# EAGLE design Tiny 5 Stick SMD -v5 (EAGLE 6.4)
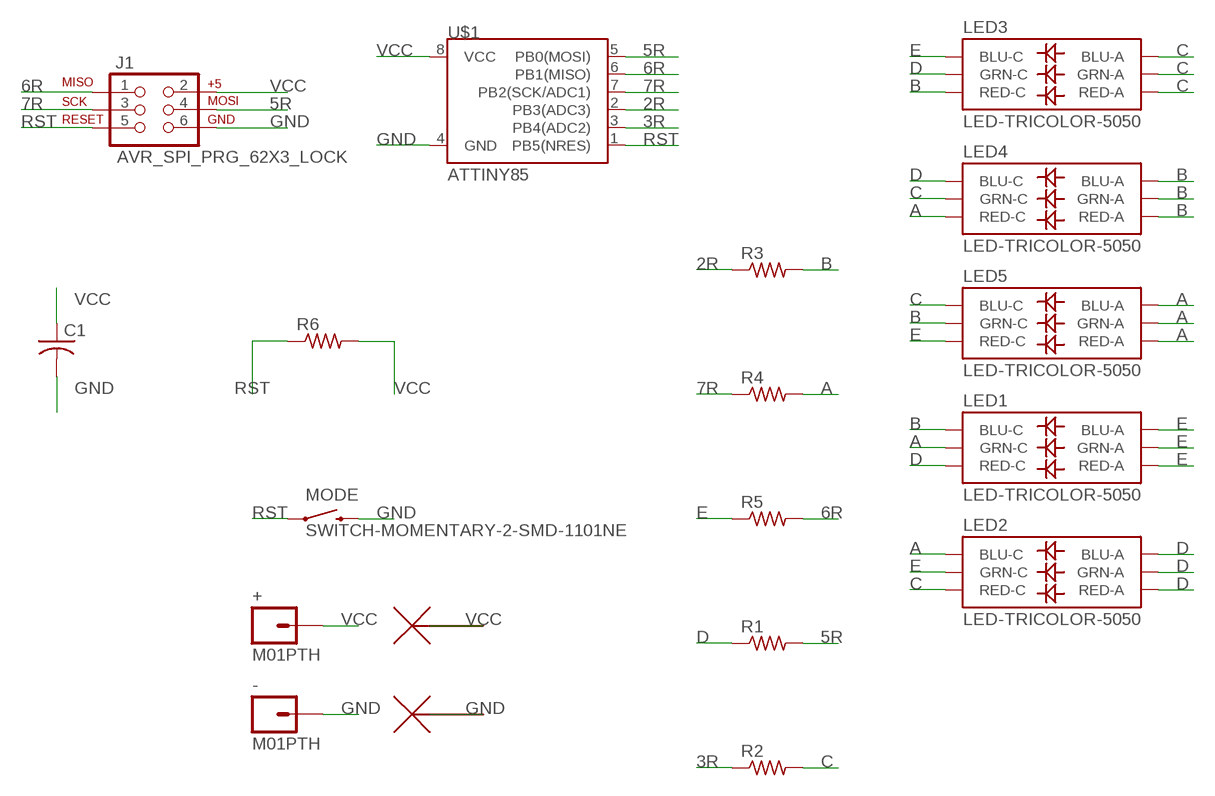
[diagram p0: schematic, sheet 1]

## Parts
+  M01PTH  [1X01]
-  M01PTH  [1X01]
C1  C-USC0805K  [C0805K]
GNDEXT  M01  [3X1.75]
J1  AVR_SPI_PRG_62X3_LOCK  [2X3_LOCK]
LED1  LED-TRICOLOR-5050  [LED-TRICOLOR-5050]
LED2  LED-TRICOLOR-5050  [LED-TRICOLOR-5050]
LED3  LED-TRICOLOR-5050  [LED-TRICOLOR-5050]
LED4  LED-TRICOLOR-5050  [LED-TRICOLOR-5050]
LED5  LED-TRICOLOR-5050  [LED-TRICOLOR-5050]
MODE  SWITCH-MOMENTARY-2-SMD-1101NE  [TACTILE-SWITCH-1101NE]
R1  R-US_M0805  [M0805]
R2  R-US_M0805  [M0805]
R3  R-US_M0805  [M0805]
R4  R-US_M0805  [M0805]
R5  R-US_M0805  [M0805]
R6  R-US_M0805  [M0805]
U$1  ATTINY85  ATTINY45  [SO08-EIAJ]
VCCEXT  M01  [3X1.75]

## Nets
2R: R3.1 U$1.2(PB3(ADC3))
3R: R2.1 U$1.3(PB4(ADC2))
5R: J1.4 R1.2 U$1.5(PB0(MOSI))
6R: J1.1 R5.2 U$1.6(PB1(MISO))
7R: J1.3 R4.1 U$1.7(PB2(SCK/ADC1))
A: LED1.4(GRN-C) LED2.6(BLU-C) LED4.5(RED-C) LED5.1(BLU-A) LED5.2(RED-A) LED5.3(GRN-A) R4.2
B: LED1.6(BLU-C) LED3.5(RED-C) LED4.1(BLU-A) LED4.2(RED-A) LED4.3(GRN-A) LED5.4(GRN-C) R3.2
C: LED2.5(RED-C) LED3.1(BLU-A) LED3.2(RED-A) LED3.3(GRN-A) LED4.4(GRN-C) LED5.6(BLU-C) R2.2
D: LED1.5(RED-C) LED2.1(BLU-A) LED2.2(RED-A) LED2.3(GRN-A) LED3.4(GRN-C) LED4.6(BLU-C) R1.1
E: LED1.1(BLU-A) LED1.2(RED-A) LED1.3(GRN-A) LED2.4(GRN-C) LED3.6(BLU-C) LED5.5(RED-C) R5.1
GND: -.1 C1.2 GNDEXT.P$1 J1.6 MODE.P$2 U$1.4(GND)
RST: J1.5 MODE.P$1 R6.1 U$1.1(PB5(NRES))
VCC: +.1 C1.1 J1.2 R6.2 U$1.8(VCC) VCCEXT.P$1

## Library data of the parts
+ - = SparkFun-Connectors:M01: Header 1 Standard 1-pin 0.1" header. Use with straight break away headers (SKU : PRT-00116), right angle break away headers (PRT-00553), swiss pins (PRT-00743), machine pins (PRT-00117), and female headers (PRT-00115).
C1 = adafruit:C-US: CAPACITOR, American symbol
GNDEXT VCCEXT = 00_PERSONAL:M01
J1 = SparkFun-Connectors:AVR_SPI_PRG_6: AVR ISP 6 Pin This is the reduced ISP connector for AVR programming. Common on Arduino. This footprint will take up less PCB space and can be used with a 10-pin to 6-pin adapter such as SKU: BOB-08508
LED1-LED5 = SparkFun:LED-TRICOLOR-5050
MODE = SparkFun-Electromechanical:SWITCH-MOMENTARY-2: Various NO switches- pushbuttons, reed, etc
R1-R6 = adafruit:R-US_: RESISTOR, American symbol
U$1 = SparkFun:ATTINY45: Atmel ATTiny45

## Board
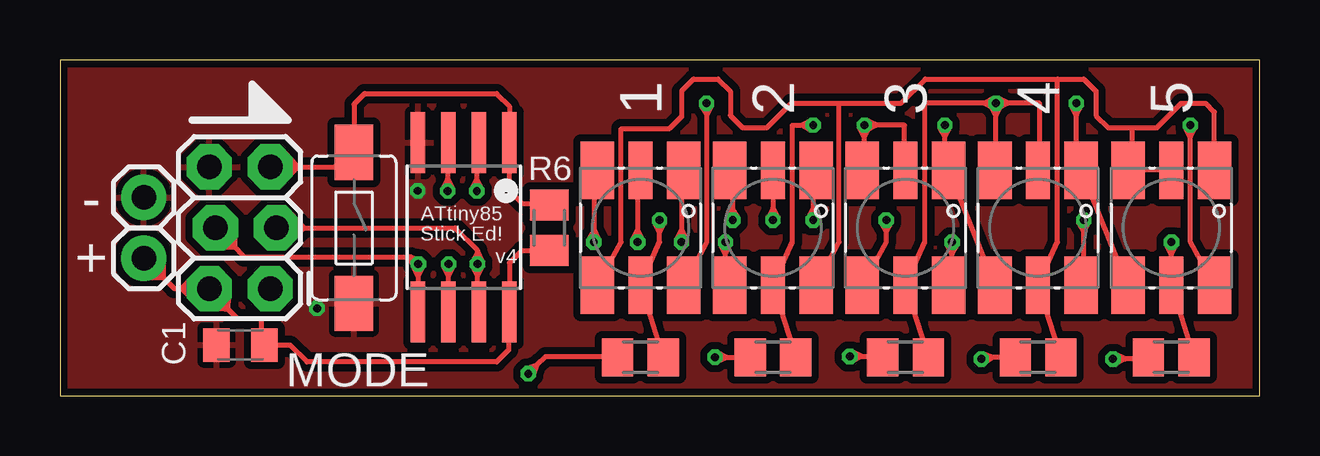
[diagram p1: board, top side]
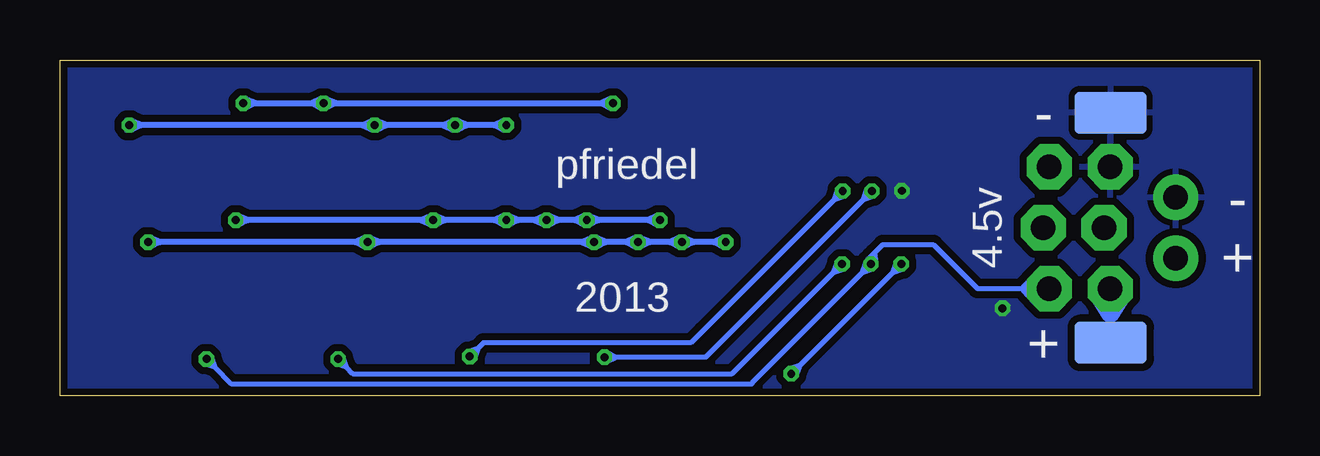
[diagram p2: board, bottom side, seen from below]

Size 50 x 14 mm. Coordinates in mm from the lower left corner, seen from the top.
Outline: 0,14 0,0 50,0 50,14 0,14
Copper layers (1*16): Top 0.035mm / dielectric 1.5mm / Bottom 0.035mm
Design rules "Fusion_eagle_rule_v1.1": minimum track width 6mil, minimum drill 12mil, track to track 6mil, track to pad 6mil, pad to pad 6mil, via to via 6mil, smd to smd 0mil, copper to edge 10mil, drill to drill 10mil, minimum pad ring 10mil, minimum via ring 6mil, stop-mask expansion 2mil, vias tented up to drill 100mil, thermal gap 10mil

### Footprints (pad centres in the part's own frame; a part is rotated, then mirrored left to right if it is on the bottom)
1X01 = drill 1.016 pad 1.88: 1 0,0
C0805K = smd 1.1 x 1.4: 1 -1,0; 2 1,0
3X1.75 = smd 3 x 1.75: P$1 0,0
2X3_LOCK = drill 1.016 pad 1.88 octagon: 1 0,0; 2 0,2.54; 3 2.54,-0.254; 4 2.54,2.286; 5 5.08,0; 6 5.08,2.54
LED-TRICOLOR-5050 = smd 2.4 x 1.4: 1 -2.4,1.8; 3 -2.4,-1.8; 4 2.4,-1.8; 6 2.4,1.8 | smd 2.4 x 1: 2 -2.4,0; 5 2.4,0
TACTILE-SWITCH-1101NE = smd 2.3 x 1.6: P$1 -3.15,0; P$2 3.15,0
M0805 = smd 1.3 x 1.6: 1 -0.95,0; 2 0.95,0
SO08-EIAJ = smd 0.61 x 2.54: 1 -1.905,-3.543; 2 -0.635,-3.543; 3 0.635,-3.543; 4 1.905,-3.543; 5 1.905,3.518; 6 0.635,3.518; 7 -0.635,3.518; 8 -1.905,3.518

### Placement (x,y rotation side)
+  3.49,5.73 180 top
-  3.49,8.27 0 top
C1  7.53,2.11 180 top
GNDEXT  6.2,11.8 0 bottom
J1  8.76,4.46 90 top
LED1  24.19,7 270 top
LED2  29.72,7 270 top
LED3  35.24,7 270 top
LED4  40.77,7 270 top
LED5  46.32,7 270 top
MODE  12.25,7 270 top
R1  24.19,1.59 180 top
R2  29.72,1.59 0 top
R3  35.24,1.59 0 top
R4  40.77,1.59 0 top
R5  46.32,1.59 180 top
R6  20.4,7 270 top
U$1  16.83,7 180 top
VCCEXT  6.2,2.2 0 bottom

### Tracks (layer width: path | path; a pad name or v marks a point on that pad's centre or on a via)
2R  (via drill 0.33)
  Top 0.203: U$1.2 arc90 17.37,10.45 17.37,9.03 | 17.37,9.03 v17.37,8.53 | v32.92,1.63 33.41,1.63 | 33.41,1.63 34.06,1.63 R3.1 | 17.37,9.03 17.18,8.63 v17.37,8.53 | 17.37,9.03 17.57,8.63 v17.37,8.53 | 33.41,1.63 33.01,1.82 v32.92,1.63 | 33.41,1.63 33.01,1.43 v32.92,1.63
  Bottom 0.203: v17.37,8.53 17.72,8.18 | 17.72,8.18 23.2,2.71 23.2,2.7 23.7,2.2 32.35,2.2 32.57,1.98 | 32.57,1.98 v32.92,1.63 | 17.72,8.18 17.58,8.61 v17.37,8.53 | 17.72,8.18 17.3,8.33 v17.37,8.53 | 32.57,1.98 32.71,1.56 v32.92,1.63 | 32.57,1.98 32.99,1.83 v32.92,1.63
3R  (via drill 0.33)
  Top 0.203: U$1.3 16.15,10.51 16.15,9.03 | 16.15,9.03 v16.15,8.53 | 28.7,1.52 R2.1 27.8,1.59 | v27.3,1.6 v27.3,1.59 27.8,1.59 | 16.15,9.03 15.96,8.63 v16.15,8.53 | 16.15,9.03 16.35,8.63 v16.15,8.53 | 27.8,1.59 27.4,1.79 v27.3,1.6 | 27.8,1.59 27.39,1.41 v27.3,1.6
  Bottom 0.203: v16.15,8.53 16.5,8.18 | 16.5,8.18 23.09,1.6 26.8,1.6 | 26.8,1.6 v27.3,1.6 | 16.5,8.18 16.36,8.61 v16.15,8.53 | 16.5,8.18 16.08,8.33 v16.15,8.53 | 26.8,1.6 27.21,1.41 v27.3,1.6 | 26.8,1.6 27.21,1.79 v27.3,1.6
5R  (via drill 0.33)
  Top 0.203: R1.2 23.27,1.62 20.23,1.62 19.87,1.26 | v14.94,5.49 14.92,5.47 14.92,4.99 | 14.92,4.99 U$1.5 | J1.4 7.2,6.28 7.69,5.79 14.54,5.79 | 14.54,5.79 14.63,5.79 v14.94,5.49 | 19.87,1.26 v19.52,0.91 | 19.87,1.26 19.45,1.12 v19.52,0.91 | 19.87,1.26 19.73,0.84 v19.52,0.91 | 14.92,4.99 15.13,5.39 v14.94,5.49 | 14.92,4.99 14.74,5.4 v14.94,5.49 | 14.54,5.79 14.74,5.39 v14.94,5.49 | 14.54,5.79 14.98,5.7 v14.94,5.49
  Top 0.406: 7.2,6.28 7.21,6.98 J1.4 6.5,6.26 7.2,6.28
  Bottom 0.203: v14.94,5.49 15.29,5.14 | 15.29,5.14 19.16,1.26 | 19.16,1.26 19.51,0.91 v19.52,0.91 | 19.16,1.26 19.32,0.84 v19.52,0.91 | 19.16,1.26 19.59,1.12 v19.52,0.91 | 15.29,5.14 15.14,5.56 v14.94,5.49 | 15.29,5.14 14.86,5.28 v14.94,5.49
6R  (via drill 0.33)
  Top 0.203: R5.2 45.3,1.52 44.39,1.52 | 44.39,1.52 v43.89,1.52 | U$1.6 16.19,4.99 | 16.19,4.99 16.19,5.39 v16.2,5.49 | 44.39,1.52 43.98,1.72 v43.89,1.52 | 44.39,1.52 43.98,1.33 v43.89,1.52 | 16.19,4.99 16.39,5.39 v16.2,5.49 | 16.19,4.99 16,5.39 v16.2,5.49
  Bottom 0.203: J1.1 9.78,4.46 11.76,4.46 13.6,6.3 15.7,6.3 16.04,5.96 | 43.54,1.17 42.87,0.5 21.14,0.5 21.14,0.55 16.55,5.14 | 43.54,1.17 v43.89,1.52 | 16.55,5.14 v16.2,5.49 | v16.2,5.49 16.2,5.8 16.04,5.96 | 43.54,1.17 43.96,1.32 v43.89,1.52 | 43.54,1.17 43.69,1.59 v43.89,1.52 | 16.55,5.14 16.4,5.56 v16.2,5.49 | 16.55,5.14 16.13,5.28 v16.2,5.49 | 16.04,5.96 15.99,5.51 v16.2,5.49 | 16.04,5.96 16.36,5.64 v16.2,5.49
  Bottom 0.406: 9.78,4.46 9.3,4.97 J1.1 9.3,3.95 9.78,4.46
7R  (via drill 0.33)
  Top 0.203: R4.1 38.9,1.59 | 38.9,1.59 38.48,1.59 v38.41,1.52 | J1.3 10.03,7 16.47,7 17.4,6.07 17.4,5.98 | U$1.7 17.4,3.54 17.4,4.99 | 17.4,4.99 v17.4,5.49 | 17.4,5.98 v17.4,5.49 | 38.9,1.59 38.47,1.73 v38.41,1.52 | 38.9,1.59 38.53,1.34 v38.41,1.52 | 17.4,4.99 17.59,5.39 v17.4,5.49 | 17.4,4.99 17.21,5.39 v17.4,5.49 | 17.4,5.98 17.21,5.58 v17.4,5.49 | 17.4,5.98 17.59,5.58 v17.4,5.49
  Top 0.406: 10.03,7 9.55,7.51 J1.3 9.55,6.49 10.03,7
  Bottom 0.203: 38.05,1.17 37.8,0.91 21.99,0.91 v17.4,5.49 | 38.05,1.17 v38.41,1.52 | 38.05,1.17 38.48,1.32 v38.41,1.52 | 38.05,1.17 38.2,1.59 v38.41,1.52 | v17.4,5.49 17.6,5.56 17.75,5.14 17.33,5.28 v17.4,5.49
A
  Top 0.203: LED1.4 23.39,6.4 23.39,11.12 25.4,11.12 25.91,11.63 25.91,12.7 26.42,13.21 27.43,13.21 27.94,12.7 27.94,11.68 28.45,11.18 29.46,11.18 30.48,12.19 32.47,12.19 | R4.2 LED4.5 41.58,6.4 41.58,13.21 | LED2.6 32.47,6.4 32.47,12.19 | LED5.3 44.5,9.42 | 46.33,9.41 LED5.2 LED5.3 | 32.47,12.19 35.05,12.19 36.07,13.21 41.58,13.21 | 41.58,13.21 42.67,13.21 43.18,12.7 43.18,11.68 43.69,11.18 44.7,11.18 | LED5.3 44.2,9.4 | LED5.1 48.12,11.83 47.75,12.19 46.74,12.19 45.72,11.18 44.7,11.18 | LED5.3 44.7,9.59 44.7,11.18
B  (via drill 0.33)
  Top 0.203: LED1.6 26.96,6.4 26.96,11.7 | 26.96,11.7 v26.95,12.19 | R3.2 LED3.5 36.04,6.4 36.04,12.19 38.52,12.19 | LED4.3 39.01,9.4 39.01,11.7 | 39.01,11.7 v39.01,12.19 | v39.01,12.19 38.52,12.19 | LED4.2 40.84,9.4 40.84,12.19 39.51,12.19 | 39.51,12.19 v39.01,12.19 | 42.37,11.7 42.37,9.4 LED4.1 LED5.4 | 42.37,11.7 v42.37,12.19 | 26.96,11.7 27.16,12.07 v26.95,12.19 | 26.96,11.7 | 26.96,11.7 26.74,12.07 v26.95,12.19 | 39.01,11.7 39.23,12.07 v39.01,12.19 | 39.01,11.7 38.8,12.07 v39.01,12.19 | 38.52,12.19 38.9,11.98 v39.01,12.19 | 38.52,12.19 38.9,12.4 v39.01,12.19 | 39.51,12.19 39.13,12.4 v39.01,12.19 | 39.51,12.19 39.13,11.98 v39.01,12.19 | 42.37,11.7 42.58,12.07 v42.37,12.19 | 42.37,11.7 42.16,12.07 v42.37,12.19 | 26.96,11.7 27.15,12.1 | 27.15,12.1 | v26.95,12.19 27.15,12.1 | 26.96,11.7 26.76,12.09 | 26.76,12.09 | v26.95,12.19 26.76,12.09 | 26.96,11.7 27.15,12.1 | 27.15,12.1 | v26.95,12.19 27.15,12.1 | 26.96,11.7 26.76,12.09 | v26.95,12.19 26.76,12.09 | 26.96,11.7 27.15,12.1 | v26.95,12.19 27.15,12.1 | 26.96,11.7 26.76,12.09 | v26.95,12.19 26.76,12.09 | 39.01,11.7 39.21,12.1 | v39.01,12.19 39.21,12.1 | 39.01,11.7 38.82,12.1 | v39.01,12.19 38.82,12.1 | 38.52,12.19 | 38.52,12.19 38.92,12 | v39.01,12.19 38.92,12 | 38.52,12.19 | 38.52,12.19 38.92,12.39 | v39.01,12.19 38.92,12.39 | 39.51,12.19 39.11,12.39 | v39.01,12.19 39.11,12.39 | 39.51,12.19 39.11,12 | v39.01,12.19 39.11,12 | 39.01,11.7 39.21,12.1 | 39.21,12.1 | 39.01,11.7 38.82,12.1 | v39.01,12.19 38.82,12.1 | 39.01,11.7 39.21,12.1 | v39.01,12.19 39.21,12.1 | 39.01,11.7 38.82,12.1 | v39.01,12.19 38.82,12.1 | 38.52,12.19 38.92,12 | 38.92,12 | 38.52,12.19 38.92,12.39 | v39.01,12.19 38.92,12.39 | 38.52,12.19 38.92,12 | v39.01,12.19 38.92,12
  Top 0.203: 38.52,12.19 38.92,12.39 | v39.01,12.19 38.92,12.39 | 39.51,12.19 39.11,12.39 | 39.11,12.39 | 39.51,12.19 39.11,12 | v39.01,12.19 39.11,12 | 39.51,12.19 39.11,12.39 | v39.01,12.19 39.11,12.39 | 39.51,12.19 39.11,12 | v39.01,12.19 39.11,12 | 42.37,11.7 42.56,12.1 | v42.37,12.19 42.56,12.1 | 42.37,11.7 42.17,12.1 | v42.37,12.19 42.17,12.1 | 42.37,11.7 42.56,12.1 | 42.56,12.1 | 42.37,11.7 42.17,12.1 | v42.37,12.19 42.17,12.1 | 42.37,11.7 42.56,12.1 | v42.37,12.19 42.56,12.1 | 42.37,11.7 42.17,12.1 | v42.37,12.19 42.17,12.1
  Bottom 0.254: v42.37,12.19 41.87,12.19 | 41.87,12.19 39.51,12.19 | 39.51,12.19 v39.01,12.19 | v39.01,12.19 38.52,12.19 | 38.52,12.19 27.45,12.19 | 27.45,12.19 v26.95,12.19 | 27.45,12.19 27.04,12.39 v26.95,12.19 | 27.45,12.19 27.04,12 v26.95,12.19 | 39.51,12.19 39.11,12.39 v39.01,12.19 | 39.51,12.19 39.11,12 v39.01,12.19 | 38.52,12.19 | 38.52,12.19 38.92,12 v39.01,12.19 | 38.52,12.19 38.92,12.39 v39.01,12.19 | 41.87,12.19 | 41.87,12.19 42.27,12 v42.37,12.19 | 41.87,12.19 42.27,12.39 v42.37,12.19 | 27.45,12.19 27.02,12.37 | v26.95,12.19 27.02,12.37 | 27.45,12.19 27.02,12.02 | v26.95,12.19 27.02,12.02 | 27.45,12.19 27.02,12.37 | 27.02,12.37 | v26.95,12.19 27.02,12.37 | 27.45,12.19 27.02,12.02 | v26.95,12.19 27.02,12.02 | 27.45,12.19 27.02,12.37 | v26.95,12.19 27.02,12.37 | 27.45,12.19 27.02,12.02 | v26.95,12.19 27.02,12.02 | 39.51,12.19 39.09,12.37 | v39.01,12.19 39.09,12.37 | 39.51,12.19 39.09,12.02 | v39.01,12.19 39.09,12.02 | 38.52,12.19 38.94,12.02 | v39.01,12.19 38.94,12.02 | 38.52,12.19 | 38.52,12.19 38.94,12.37 | v39.01,12.19 38.94,12.37 | 39.51,12.19 39.09,12.37 | 39.09,12.37 | v39.01,12.19 39.09,12.37 | 39.51,12.19 39.09,12.02 | v39.01,12.19 39.09,12.02 | 39.51,12.19 39.09,12.37 | v39.01,12.19 39.09,12.37 | 39.51,12.19 39.09,12.02 | v39.01,12.19 39.09,12.02 | 38.52,12.19 38.94,12.02 | 38.94,12.02 | v39.01,12.19 38.94,12.02 | 38.52,12.19 38.94,12.37 | v39.01,12.19 38.94,12.37 | 38.52,12.19 38.94,12.02 | v39.01,12.19 38.94,12.02 | 38.52,12.19 38.94,12.37 | v39.01,12.19 38.94,12.37 | 41.87,12.19 42.29,12.02 | v42.37,12.19 42.29,12.02 | 41.87,12.19 | 41.87,12.19 42.29,12.37 | v42.37,12.19 42.29,12.37 | 41.87,12.19 42.29,12.02 | 42.29,12.02 | v42.37,12.19 42.29,12.02 | 41.87,12.19 42.29,12.37
  Bottom 0.254: v42.37,12.19 42.29,12.37 | 41.87,12.19 42.29,12.02 | v42.37,12.19 42.29,12.02 | 41.87,12.19 42.29,12.37 | v42.37,12.19 42.29,12.37
C  (via drill 0.33)
  Top 0.203: R2.2 LED2.5 30.53,6.4 30.53,11.28 30.9,11.28 | LED3.3 33.53,9.49 33.53,10.78 | 33.53,10.78 v33.53,11.28 | LED3.2 35.2,9.44 35.2,11.28 34.02,11.28 | 34.02,11.28 v33.53,11.28 | 30.9,11.28 v31.39,11.28 | LED4.4 LED3.1 36.88,9.41 36.88,10.78 | 36.88,10.78 v36.88,11.28 | LED5.6 47.12,6.4 47.12,10.78 | 47.12,10.78 v47.12,11.28 | 33.53,10.78 33.74,11.16 v33.53,11.28 | 33.53,10.78 33.32,11.16 v33.53,11.28 | 34.02,11.28 33.65,11.49 v33.53,11.28 | 34.02,11.28 33.65,11.07 v33.53,11.28 | 30.9,11.28 31.28,11.07 v31.39,11.28 | 30.9,11.28 31.28,11.49 v31.39,11.28 | 36.88,10.78 37.09,11.16 v36.88,11.28 | 36.88,10.78 36.67,11.16 v36.88,11.28 | 47.12,10.78 47.33,11.16 v47.12,11.28 | 47.12,10.78 46.91,11.16 v47.12,11.28 | 33.53,10.78 33.72,11.18 | v33.53,11.28 33.72,11.18 | 33.53,10.78 33.33,11.18 | v33.53,11.28 33.33,11.18 | 34.02,11.28 33.62,11.47 | v33.53,11.28 33.62,11.47 | 34.02,11.28 33.62,11.08 | v33.53,11.28 33.62,11.08 | 33.53,10.78 33.72,11.18 | 33.72,11.18 | 33.53,10.78 33.33,11.18 | v33.53,11.28 33.33,11.18 | 33.53,10.78 33.72,11.18 | v33.53,11.28 33.72,11.18 | 33.53,10.78 33.33,11.18 | v33.53,11.28 33.33,11.18 | 34.02,11.28 33.62,11.47 | 33.62,11.47 | 34.02,11.28 33.62,11.08 | v33.53,11.28 33.62,11.08 | 34.02,11.28 33.62,11.47 | v33.53,11.28 33.62,11.47 | 34.02,11.28 33.62,11.08 | v33.53,11.28 33.62,11.08 | 30.9,11.28 | 30.9,11.28 31.3,11.08 | v31.39,11.28 31.3,11.08 | 30.9,11.28 | 30.9,11.28 31.3,11.47 | v31.39,11.28 31.3,11.47 | 30.9,11.28 31.3,11.08 | 31.3,11.08 | 30.9,11.28 31.3,11.47 | v31.39,11.28 31.3,11.47 | 30.9,11.28 31.3,11.08 | v31.39,11.28 31.3,11.08 | 30.9,11.28 31.3,11.47 | v31.39,11.28 31.3,11.47 | 36.88,10.78 37.08,11.18 | v36.88,11.28 37.08,11.18
  Top 0.203: 36.88,10.78 36.69,11.18 | v36.88,11.28 36.69,11.18 | 36.88,10.78 37.08,11.18 | 37.08,11.18 | 36.88,10.78 36.69,11.18 | v36.88,11.28 36.69,11.18 | 36.88,10.78 37.08,11.18 | v36.88,11.28 37.08,11.18 | 36.88,10.78 36.69,11.18 | v36.88,11.28 36.69,11.18 | 47.12,10.78 47.31,11.18 | v47.12,11.28 47.31,11.18 | 47.12,10.78 46.92,11.18 | v47.12,11.28 46.92,11.18 | 47.12,10.78 47.31,11.18 | 47.31,11.18 | 47.12,10.78 46.92,11.18 | v47.12,11.28 46.92,11.18 | 47.12,10.78 47.31,11.18 | v47.12,11.28 47.31,11.18 | 47.12,10.78 46.92,11.18 | v47.12,11.28 46.92,11.18
  Bottom 0.254: v31.39,11.28 31.89,11.28 | 31.89,11.28 33.03,11.28 | 33.03,11.28 v33.53,11.28 | v33.53,11.28 34.02,11.28 | 34.02,11.28 36.38,11.28 | 36.39,11.28 v36.88,11.28 | v36.88,11.28 37.38,11.28 | 37.38,11.28 46.62,11.28 | 46.62,11.28 v47.12,11.28 | 33.03,11.28 | 33.03,11.28 33.43,11.08 v33.53,11.28 | 33.03,11.28 33.43,11.47 v33.53,11.28 | 34.02,11.28 33.62,11.47 v33.53,11.28 | 34.02,11.28 33.62,11.08 v33.53,11.28 | 31.89,11.28 31.49,11.47 v31.39,11.28 | 31.89,11.28 31.49,11.08 v31.39,11.28 | 36.38,11.28 36.39,11.28 | 36.39,11.28 36.79,11.08 v36.88,11.28 | 36.39,11.28 36.79,11.47 v36.88,11.28 | 37.38,11.28 36.98,11.47 v36.88,11.28 | 37.38,11.28 36.98,11.08 v36.88,11.28 | 46.62,11.28 | 46.62,11.28 47.02,11.08 v47.12,11.28 | 46.62,11.28 47.02,11.47 v47.12,11.28 | v47.12,11.28 47.21,11.47 | v47.12,11.28 47.21,11.08 | 33.03,11.28 33.45,11.1 | v33.53,11.28 33.45,11.1 | 33.03,11.28 | 33.03,11.28 33.45,11.45 | v33.53,11.28 33.45,11.45 | 34.02,11.28 33.6,11.45 | v33.53,11.28 33.6,11.45 | 34.02,11.28 33.6,11.1 | v33.53,11.28 33.6,11.1 | 33.03,11.28 33.45,11.1 | 33.45,11.1 | v33.53,11.28 33.45,11.1 | 33.03,11.28 33.45,11.45 | v33.53,11.28 33.45,11.45 | 33.03,11.28 33.45,11.1 | v33.53,11.28 33.45,11.1 | 33.03,11.28 33.45,11.45 | v33.53,11.28 33.45,11.45 | 34.02,11.28 33.6,11.45 | 33.6,11.45 | v33.53,11.28 33.6,11.45 | 34.02,11.28 33.6,11.1 | v33.53,11.28 33.6,11.1 | 34.02,11.28 33.6,11.45 | v33.53,11.28 33.6,11.45 | 34.02,11.28 33.6,11.1 | v33.53,11.28 33.6,11.1 | 31.89,11.28 31.47,11.45 | v31.39,11.28 31.47,11.45 | 31.89,11.28 31.47,11.1 | v31.39,11.28 31.47,11.1 | 31.89,11.28 31.47,11.45 | 31.47,11.45 | v31.39,11.28 31.47,11.45 | 31.89,11.28 31.47,11.1 | v31.39,11.28 31.47,11.1
  Bottom 0.254: 31.89,11.28 31.47,11.45 | v31.39,11.28 31.47,11.45 | 31.89,11.28 31.47,11.1 | v31.39,11.28 31.47,11.1 | 36.39,11.28 36.81,11.1 | v36.88,11.28 36.81,11.1 | 36.38,11.28 36.39,11.28 | 36.39,11.28 36.81,11.45 | v36.88,11.28 36.81,11.45 | 37.38,11.28 36.95,11.45 | v36.88,11.28 36.95,11.45 | 37.38,11.28 36.95,11.1 | v36.88,11.28 36.95,11.1 | 36.39,11.28 36.81,11.1 | 36.81,11.1 | v36.88,11.28 36.81,11.1 | 36.39,11.28 36.81,11.45 | v36.88,11.28 36.81,11.45 | 36.39,11.28 36.81,11.1 | v36.88,11.28 36.81,11.1 | 36.39,11.28 36.81,11.45 | v36.88,11.28 36.81,11.45 | 37.38,11.28 36.95,11.45 | 36.95,11.45 | v36.88,11.28 36.95,11.45 | 37.38,11.28 36.95,11.1 | v36.88,11.28 36.95,11.1 | 37.38,11.28 36.95,11.45 | v36.88,11.28 36.95,11.45 | 37.38,11.28 36.95,11.1 | v36.88,11.28 36.95,11.1 | 46.62,11.28 47.04,11.1 | v47.12,11.28 47.04,11.1 | 46.62,11.28 | 46.62,11.28 47.04,11.45 | v47.12,11.28 47.04,11.45 | 46.62,11.28 47.04,11.1 | 47.04,11.1 | v47.12,11.28 47.04,11.1 | 46.62,11.28 47.04,11.45 | v47.12,11.28 47.04,11.45 | 46.62,11.28 47.04,11.1 | v47.12,11.28 47.04,11.1 | 46.62,11.28 47.04,11.45 | v47.12,11.28 47.04,11.45
D  (via drill 0.33)
  Top 0.203: 24.99,6.82 24.99,6.4 LED1.5 R1.1 | 24.99,6.82 v24.99,7.32 | LED2.3 28.04,9.4 28.04,7.81 | 28.04,7.81 v28.04,7.32 | LED2.2 29.72,7.81 | 29.72,7.81 v29.72,7.32 | LED2.1 31.39,9.4 31.39,7.81 | 31.39,7.81 v31.39,7.32 | LED3.4 34.44,6.4 34.44,6.82 | 34.44,6.82 v34.44,7.32 | LED4.6 42.67,4.71 42.67,6.82 | 42.67,6.82 v42.67,7.32 | 24.99,6.82 25.2,7.2 v24.99,7.32 | 24.99,6.82 24.78,7.2 v24.99,7.32 | 28.04,7.81 27.83,7.43 v28.04,7.32 | 28.04,7.81 28.25,7.43 v28.04,7.32 | 29.72,7.81 29.51,7.43 v29.72,7.32 | 29.72,7.81 29.93,7.43 v29.72,7.32 | 31.39,7.81 31.18,7.43 v31.39,7.32 | 31.39,7.81 31.61,7.43 v31.39,7.32 | 34.44,6.82 34.65,7.2 v34.44,7.32 | 34.44,6.82 34.23,7.2 v34.44,7.32 | 42.67,6.82 42.88,7.2 v42.67,7.32 | 42.67,6.82 42.46,7.2 v42.67,7.32 | 24.99,6.82 25.19,7.22 | v24.99,7.32 25.19,7.22 | 24.99,6.82 24.8,7.22 | v24.99,7.32 24.8,7.22 | 24.99,6.82 25.19,7.22 | 25.19,7.22 | 24.99,6.82 24.8,7.22 | v24.99,7.32 24.8,7.22 | 24.99,6.82 25.19,7.22 | v24.99,7.32 25.19,7.22 | 24.99,6.82 24.8,7.22 | v24.99,7.32 24.8,7.22 | 28.04,7.81 | 28.04,7.81 27.85,7.41 | v28.04,7.32 27.85,7.41 | 28.04,7.81 | 28.04,7.81 28.24,7.41 | v28.04,7.32 28.24,7.41 | 28.04,7.81 27.85,7.41 | 27.85,7.41 | 28.04,7.81 28.24,7.41 | v28.04,7.32 28.24,7.41 | 28.04,7.81 27.85,7.41 | v28.04,7.32 27.85,7.41 | 28.04,7.81 28.24,7.41 | v28.04,7.32 28.24,7.41 | 29.72,7.81 | 29.72,7.81 29.52,7.41 | v29.72,7.32 29.52,7.41 | 29.72,7.81 | 29.72,7.81 29.91,7.41 | v29.72,7.32 29.91,7.41 | 29.72,7.81 29.52,7.41 | 29.52,7.41 | 29.72,7.81 29.91,7.41 | v29.72,7.32 29.91,7.41 | 29.72,7.81 29.52,7.41 | v29.72,7.32 29.52,7.41 | 29.72,7.81 29.91,7.41 | v29.72,7.32 29.91,7.41 | 31.39,7.81 | 31.39,7.81 31.2,7.41 | v31.39,7.32 31.2,7.41
  Top 0.203: 31.39,7.81 | 31.39,7.81 31.59,7.41 | v31.39,7.32 31.59,7.41 | 31.39,7.81 31.2,7.41 | 31.2,7.41 | 31.39,7.81 31.59,7.41 | v31.39,7.32 31.59,7.41 | 31.39,7.81 31.2,7.41 | v31.39,7.32 31.2,7.41 | 31.39,7.81 31.59,7.41 | v31.39,7.32 31.59,7.41 | 34.44,6.82 34.64,7.22 | v34.44,7.32 34.64,7.22 | 34.44,6.82 34.25,7.22 | v34.44,7.32 34.25,7.22 | 34.44,6.82 34.64,7.22 | 34.64,7.22 | 34.44,6.82 34.25,7.22 | v34.44,7.32 34.25,7.22 | 34.44,6.82 34.64,7.22 | v34.44,7.32 34.64,7.22 | 34.44,6.82 34.25,7.22 | v34.44,7.32 34.25,7.22 | 42.67,6.82 42.87,7.22 | v42.67,7.32 42.87,7.22 | 42.67,6.82 42.48,7.22 | v42.67,7.32 42.48,7.22 | 42.67,6.82 42.87,7.22 | 42.87,7.22 | 42.67,6.82 42.48,7.22 | v42.67,7.32 42.48,7.22 | 42.67,6.82 42.87,7.22 | v42.67,7.32 42.87,7.22 | 42.67,6.82 42.48,7.22 | v42.67,7.32 42.48,7.22
  Bottom 0.254: v24.99,7.32 25.49,7.32 | 25.49,7.32 27.55,7.32 | 27.55,7.32 v28.04,7.32 | v28.04,7.32 28.54,7.32 | 28.54,7.32 29.22,7.32 | 29.22,7.32 v29.72,7.32 | v29.72,7.32 30.21,7.32 | 30.21,7.32 30.9,7.32 | 30.9,7.32 v31.39,7.32 | v31.39,7.32 31.89,7.32 | 31.89,7.32 33.95,7.32 | 33.95,7.32 v34.44,7.32 | v34.44,7.32 34.94,7.32 | 34.94,7.32 42.18,7.32 | 42.18,7.32 v42.67,7.32 | 25.49,7.32 25.09,7.51 v24.99,7.32 | 25.49,7.32 25.09,7.12 v24.99,7.32 | 27.55,7.32 | 27.55,7.32 27.95,7.12 v28.04,7.32 | 27.55,7.32 27.95,7.51 v28.04,7.32 | 28.54,7.32 28.14,7.51 v28.04,7.32 | 28.54,7.32 28.14,7.12 v28.04,7.32 | 29.22,7.32 | 29.22,7.32 29.62,7.12 v29.72,7.32 | 29.22,7.32 29.62,7.51 v29.72,7.32 | 30.21,7.32 29.81,7.51 v29.72,7.32 | 30.21,7.32 29.81,7.12 v29.72,7.32 | 30.9,7.32 | 30.9,7.32 31.3,7.12 v31.39,7.32 | 30.9,7.32 31.3,7.51 v31.39,7.32 | 31.89,7.32 31.49,7.51 v31.39,7.32 | 31.89,7.32 31.49,7.12 v31.39,7.32 | 33.95,7.32 | 33.95,7.32 34.35,7.12 v34.44,7.32 | 33.95,7.32 34.35,7.51 v34.44,7.32 | 34.94,7.32 34.54,7.51 v34.44,7.32 | 34.94,7.32 34.54,7.12 v34.44,7.32 | 42.18,7.32 | 42.18,7.32 42.58,7.12 v42.67,7.32 | 42.18,7.32 42.58,7.51 v42.67,7.32 | 25.49,7.32 25.07,7.49 | v24.99,7.32 25.07,7.49 | 25.49,7.32 25.07,7.14 | v24.99,7.32 25.07,7.14 | 25.49,7.32 25.07,7.49 | 25.07,7.49 | v24.99,7.32 25.07,7.49 | 25.49,7.32 25.07,7.14 | v24.99,7.32 25.07,7.14 | 25.49,7.32 25.07,7.49 | v24.99,7.32 25.07,7.49 | 25.49,7.32 25.07,7.14 | v24.99,7.32 25.07,7.14 | 27.55,7.32 27.97,7.14 | v28.04,7.32 27.97,7.14 | 27.55,7.32 | 27.55,7.32 27.97,7.49 | v28.04,7.32 27.97,7.49 | 28.54,7.32 28.11,7.49 | v28.04,7.32 28.11,7.49 | 28.54,7.32 28.11,7.14 | v28.04,7.32 28.11,7.14 | 27.55,7.32 27.97,7.14 | 27.97,7.14
  Bottom 0.254: v28.04,7.32 27.97,7.14 | 27.55,7.32 27.97,7.49 | v28.04,7.32 27.97,7.49 | 27.55,7.32 27.97,7.14 | v28.04,7.32 27.97,7.14 | 27.55,7.32 27.97,7.49 | v28.04,7.32 27.97,7.49 | 28.54,7.32 28.11,7.49 | 28.11,7.49 | v28.04,7.32 28.11,7.49 | 28.54,7.32 28.11,7.14 | v28.04,7.32 28.11,7.14 | 28.54,7.32 28.11,7.49 | v28.04,7.32 28.11,7.49 | 28.54,7.32 28.11,7.14 | v28.04,7.32 28.11,7.14 | 29.22,7.32 29.64,7.14 | v29.72,7.32 29.64,7.14 | 29.22,7.32 | 29.22,7.32 29.64,7.49 | v29.72,7.32 29.64,7.49 | 30.21,7.32 29.79,7.49 | v29.72,7.32 29.79,7.49 | 30.21,7.32 29.79,7.14 | v29.72,7.32 29.79,7.14 | 29.22,7.32 29.64,7.14 | 29.64,7.14 | v29.72,7.32 29.64,7.14 | 29.22,7.32 29.64,7.49 | v29.72,7.32 29.64,7.49 | 29.22,7.32 29.64,7.14 | v29.72,7.32 29.64,7.14 | 29.22,7.32 29.64,7.49 | v29.72,7.32 29.64,7.49 | 30.21,7.32 29.79,7.49 | 29.79,7.49 | v29.72,7.32 29.79,7.49 | 30.21,7.32 29.79,7.14 | v29.72,7.32 29.79,7.14 | 30.21,7.32 29.79,7.49 | v29.72,7.32 29.79,7.49 | 30.21,7.32 29.79,7.14 | v29.72,7.32 29.79,7.14 | 30.9,7.32 31.32,7.14 | v31.39,7.32 31.32,7.14 | 30.9,7.32 | 30.9,7.32 31.32,7.49 | v31.39,7.32 31.32,7.49 | 31.89,7.32 31.47,7.49 | v31.39,7.32 31.47,7.49 | 31.89,7.32 31.47,7.14 | v31.39,7.32 31.47,7.14 | 30.9,7.32 31.32,7.14 | 31.32,7.14 | v31.39,7.32 31.32,7.14 | 30.9,7.32 31.32,7.49 | v31.39,7.32 31.32,7.49 | 30.9,7.32 31.32,7.14 | v31.39,7.32 31.32,7.14 | 30.9,7.32 31.32,7.49 | v31.39,7.32 31.32,7.49 | 31.89,7.32 31.47,7.49 | 31.47,7.49 | v31.39,7.32 31.47,7.49 | 31.89,7.32 31.47,7.14 | v31.39,7.32 31.47,7.14 | 31.89,7.32 31.47,7.49 | v31.39,7.32 31.47,7.49 | 31.89,7.32 31.47,7.14 | v31.39,7.32 31.47,7.14 | 33.95,7.32 34.37,7.14 | v34.44,7.32 34.37,7.14 | 33.95,7.32 | 33.95,7.32 34.37,7.49 | v34.44,7.32 34.37,7.49
  Bottom 0.254: 34.94,7.32 34.52,7.49 | v34.44,7.32 34.52,7.49 | 34.94,7.32 34.52,7.14 | v34.44,7.32 34.52,7.14 | 33.95,7.32 34.37,7.14 | 34.37,7.14 | v34.44,7.32 34.37,7.14 | 33.95,7.32 34.37,7.49 | v34.44,7.32 34.37,7.49 | 33.95,7.32 34.37,7.14 | v34.44,7.32 34.37,7.14 | 33.95,7.32 34.37,7.49 | v34.44,7.32 34.37,7.49 | 34.94,7.32 34.52,7.49 | 34.52,7.49 | v34.44,7.32 34.52,7.49 | 34.94,7.32 34.52,7.14 | v34.44,7.32 34.52,7.14 | 34.94,7.32 34.52,7.49 | v34.44,7.32 34.52,7.49 | 34.94,7.32 34.52,7.14 | v34.44,7.32 34.52,7.14 | 42.18,7.32 42.6,7.14 | v42.67,7.32 42.6,7.14 | 42.18,7.32 | 42.18,7.32 42.6,7.49 | v42.67,7.32 42.6,7.49 | 42.18,7.32 42.6,7.14 | 42.6,7.14 | v42.67,7.32 42.6,7.14 | 42.18,7.32 42.6,7.49 | v42.67,7.32 42.6,7.49 | 42.18,7.32 42.6,7.14 | v42.67,7.32 42.6,7.14 | 42.18,7.32 42.6,7.49 | v42.67,7.32 42.6,7.49
E  (via drill 0.33)
  Top 0.203: 22.25,9.4 22.25,6.9 | 22.25,6.9 v22.25,6.4 | 24.08,9.4 24.08,6.9 | 24.08,6.9 v24.08,6.4 | 25.91,9.4 25.91,6.9 | 25.91,6.9 v25.91,6.4 | R5.1 LED5.5 46.33,4.61 46.33,5.91 | LED2.4 27.74,4.6 27.74,5.91 | 27.74,5.91 v27.74,6.4 | LED3.6 37.19,4.74 37.19,5.91 | 37.19,5.91 v37.19,6.4 | 46.33,5.91 v46.33,6.4 | 22.25,6.9 22.04,6.52 v22.25,6.4 | 22.25,6.9 22.46,6.52 v22.25,6.4 | 24.08,6.9 23.87,6.52 v24.08,6.4 | 24.08,6.9 24.29,6.52 v24.08,6.4 | 25.91,6.9 25.7,6.52 v25.91,6.4 | 25.91,6.9 26.12,6.52 v25.91,6.4 | 27.74,5.91 27.95,6.28 v27.74,6.4 | 27.74,5.91 27.53,6.28 v27.74,6.4 | 37.19,5.91 37.4,6.28 v37.19,6.4 | 37.19,5.91 36.98,6.28 v37.19,6.4 | 46.33,5.91 46.54,6.28 v46.33,6.4 | 46.33,5.91 46.12,6.28 v46.33,6.4 | 22.25,6.9 | 22.25,6.9 22.06,6.5 | v22.25,6.4 22.06,6.5 | 22.25,6.9 | 22.25,6.9 22.45,6.5 | v22.25,6.4 22.45,6.5 | 22.25,6.9 22.06,6.5 | 22.06,6.5 | 22.25,6.9 22.45,6.5 | v22.25,6.4 22.45,6.5 | 22.25,6.9 22.06,6.5 | v22.25,6.4 22.06,6.5 | 22.25,6.9 22.45,6.5 | v22.25,6.4 22.45,6.5 | 24.08,6.9 | 24.08,6.9 23.89,6.5 | v24.08,6.4 23.89,6.5 | 24.08,6.9 | 24.08,6.9 24.27,6.5 | v24.08,6.4 24.27,6.5 | 24.08,6.9 23.89,6.5 | 23.89,6.5 | 24.08,6.9 24.27,6.5 | v24.08,6.4 24.27,6.5 | 24.08,6.9 23.89,6.5 | v24.08,6.4 23.89,6.5 | 24.08,6.9 24.27,6.5 | v24.08,6.4 24.27,6.5 | 25.91,6.9 | 25.91,6.9 25.71,6.5 | v25.91,6.4 25.71,6.5 | 25.91,6.9 | 25.91,6.9 26.1,6.5 | v25.91,6.4 26.1,6.5 | 25.91,6.9 25.71,6.5 | 25.71,6.5 | 25.91,6.9 26.1,6.5 | v25.91,6.4 26.1,6.5 | 25.91,6.9 25.71,6.5 | v25.91,6.4 25.71,6.5 | 25.91,6.9 26.1,6.5 | v25.91,6.4 26.1,6.5 | 27.74,5.91 27.93,6.31 | v27.74,6.4 27.93,6.31 | 27.74,5.91 27.54,6.31 | v27.74,6.4 27.54,6.31 | 27.74,5.91 27.93,6.31 | 27.93,6.31 | 27.74,5.91 27.54,6.31 | v27.74,6.4 27.54,6.31
  Top 0.203: 27.74,5.91 27.93,6.31 | v27.74,6.4 27.93,6.31 | 27.74,5.91 27.54,6.31 | v27.74,6.4 27.54,6.31 | 37.19,5.91 37.38,6.31 | v37.19,6.4 37.38,6.31 | 37.19,5.91 36.99,6.31 | v37.19,6.4 36.99,6.31 | 37.19,5.91 37.38,6.31 | 37.38,6.31 | 37.19,5.91 36.99,6.31 | v37.19,6.4 36.99,6.31 | 37.19,5.91 37.38,6.31 | v37.19,6.4 37.38,6.31 | 37.19,5.91 36.99,6.31 | v37.19,6.4 36.99,6.31 | 46.33,5.91 46.52,6.31 | v46.33,6.4 46.52,6.31 | 46.33,5.91 46.13,6.31 | v46.33,6.4 46.13,6.31 | 46.33,5.91 46.52,6.31 | 46.52,6.31 | 46.33,5.91 46.13,6.31 | v46.33,6.4 46.13,6.31 | 46.33,5.91 46.52,6.31 | v46.33,6.4 46.52,6.31 | 46.33,5.91 46.13,6.31 | v46.33,6.4 46.13,6.31
  Top 0.254: LED1.3 22.25,9.4 | LED1.2 24.08,9.4 | LED1.1 25.91,9.4
  Bottom 0.254: v22.25,6.4 22.75,6.4 | 22.75,6.4 23.58,6.4 | 23.58,6.4 v24.08,6.4 | v25.91,6.4 26.4,6.4 | 26.4,6.4 27.24,6.4 | 27.24,6.4 v27.74,6.4 | v27.74,6.4 28.23,6.4 | 28.23,6.4 36.69,6.4 | 36.69,6.4 v37.19,6.4 | v37.19,6.4 37.68,6.4 | 37.68,6.4 45.83,6.4 | 45.83,6.4 v46.33,6.4 | v24.08,6.4 24.57,6.4 | 24.57,6.4 25.41,6.4 | 25.41,6.4 v25.91,6.4 | 22.75,6.4 22.34,6.59 v22.25,6.4 | 22.75,6.4 22.34,6.21 v22.25,6.4 | 23.58,6.4 | 23.58,6.4 23.98,6.21 v24.08,6.4 | 23.58,6.4 23.98,6.59 v24.08,6.4 | 24.57,6.4 24.17,6.59 v24.08,6.4 | 24.57,6.4 24.17,6.21 v24.08,6.4 | 26.4,6.4 26,6.59 v25.91,6.4 | 26.4,6.4 26,6.21 v25.91,6.4 | 25.41,6.4 | 25.41,6.4 25.81,6.21 v25.91,6.4 | 25.41,6.4 25.81,6.59 v25.91,6.4 | 27.24,6.4 | 27.24,6.4 27.64,6.21 v27.74,6.4 | 27.24,6.4 27.64,6.59 v27.74,6.4 | 28.23,6.4 27.83,6.59 v27.74,6.4 | 28.23,6.4 27.83,6.21 v27.74,6.4 | 36.69,6.4 | 36.69,6.4 37.09,6.21 v37.19,6.4 | 36.69,6.4 37.09,6.59 v37.19,6.4 | 37.68,6.4 37.28,6.59 v37.19,6.4 | 37.68,6.4 37.28,6.21 v37.19,6.4 | 45.83,6.4 | 45.83,6.4 46.23,6.21 v46.33,6.4 | 45.83,6.4 46.23,6.59 v46.33,6.4 | 22.75,6.4 22.32,6.58 | v22.25,6.4 22.32,6.58 | 22.75,6.4 22.32,6.22 | v22.25,6.4 22.32,6.22 | 22.75,6.4 22.32,6.58 | 22.32,6.58 | v22.25,6.4 22.32,6.58 | 22.75,6.4 22.32,6.22 | v22.25,6.4 22.32,6.22 | 22.75,6.4 22.32,6.58 | v22.25,6.4 22.32,6.58 | 22.75,6.4 22.32,6.22 | v22.25,6.4 22.32,6.22 | 23.58,6.4 24.01,6.22 | v24.08,6.4 24.01,6.22 | 23.58,6.4 | 23.58,6.4 24.01,6.58 | v24.08,6.4 24.01,6.58 | 24.57,6.4 24.15,6.58 | v24.08,6.4 24.15,6.58 | 24.57,6.4 24.15,6.22 | v24.08,6.4 24.15,6.22 | 23.58,6.4 24.01,6.22 | 24.01,6.22 | v24.08,6.4 24.01,6.22 | 23.58,6.4 24.01,6.58 | v24.08,6.4 24.01,6.58 | 23.58,6.4 24.01,6.22 | v24.08,6.4 24.01,6.22
  Bottom 0.254: 23.58,6.4 24.01,6.58 | v24.08,6.4 24.01,6.58 | 24.57,6.4 24.15,6.58 | 24.15,6.58 | v24.08,6.4 24.15,6.58 | 24.57,6.4 24.15,6.22 | v24.08,6.4 24.15,6.22 | 24.57,6.4 24.15,6.58 | v24.08,6.4 24.15,6.58 | 24.57,6.4 24.15,6.22 | v24.08,6.4 24.15,6.22 | 26.4,6.4 25.98,6.58 | v25.91,6.4 25.98,6.58 | 26.4,6.4 25.98,6.22 | v25.91,6.4 25.98,6.22 | 25.41,6.4 25.84,6.22 | v25.91,6.4 25.84,6.22 | 25.41,6.4 | 25.41,6.4 25.84,6.58 | v25.91,6.4 25.84,6.58 | 26.4,6.4 25.98,6.58 | 25.98,6.58 | v25.91,6.4 25.98,6.58 | 26.4,6.4 25.98,6.22 | v25.91,6.4 25.98,6.22 | 26.4,6.4 25.98,6.58 | v25.91,6.4 25.98,6.58 | 26.4,6.4 25.98,6.22 | v25.91,6.4 25.98,6.22 | 25.41,6.4 25.84,6.22 | 25.84,6.22 | v25.91,6.4 25.84,6.22 | 25.41,6.4 25.84,6.58 | v25.91,6.4 25.84,6.58 | 25.41,6.4 25.84,6.22 | v25.91,6.4 25.84,6.22 | 25.41,6.4 25.84,6.58 | v25.91,6.4 25.84,6.58 | 27.24,6.4 27.66,6.22 | v27.74,6.4 27.66,6.22 | 27.24,6.4 | 27.24,6.4 27.66,6.58 | v27.74,6.4 27.66,6.58 | 28.23,6.4 27.81,6.58 | v27.74,6.4 27.81,6.58 | 28.23,6.4 27.81,6.22 | v27.74,6.4 27.81,6.22 | 27.24,6.4 27.66,6.22 | 27.66,6.22 | v27.74,6.4 27.66,6.22 | 27.24,6.4 27.66,6.58 | v27.74,6.4 27.66,6.58 | 27.24,6.4 27.66,6.22 | v27.74,6.4 27.66,6.22 | 27.24,6.4 27.66,6.58 | v27.74,6.4 27.66,6.58 | 28.23,6.4 27.81,6.58 | 27.81,6.58 | v27.74,6.4 27.81,6.58 | 28.23,6.4 27.81,6.22 | v27.74,6.4 27.81,6.22 | 28.23,6.4 27.81,6.58 | v27.74,6.4 27.81,6.58 | 28.23,6.4 27.81,6.22 | v27.74,6.4 27.81,6.22 | 36.69,6.4 37.11,6.22 | v37.19,6.4 37.11,6.22 | 36.69,6.4 | 36.69,6.4 37.11,6.58 | v37.19,6.4 37.11,6.58 | 37.68,6.4 37.26,6.58 | v37.19,6.4 37.26,6.58 | 37.68,6.4 37.26,6.22 | v37.19,6.4 37.26,6.22 | 36.69,6.4 37.11,6.22 | 37.11,6.22 | v37.19,6.4 37.11,6.22 | 36.69,6.4 37.11,6.58 | v37.19,6.4 37.11,6.58
  Bottom 0.254: 36.69,6.4 37.11,6.22 | v37.19,6.4 37.11,6.22 | 36.69,6.4 37.11,6.58 | v37.19,6.4 37.11,6.58 | 37.68,6.4 37.26,6.58 | 37.26,6.58 | v37.19,6.4 37.26,6.58 | 37.68,6.4 37.26,6.22 | v37.19,6.4 37.26,6.22 | 37.68,6.4 37.26,6.58 | v37.19,6.4 37.26,6.58 | 37.68,6.4 37.26,6.22 | v37.19,6.4 37.26,6.22 | 45.83,6.4 46.26,6.22 | v46.33,6.4 46.26,6.22 | 45.83,6.4 | 45.83,6.4 46.26,6.58 | v46.33,6.4 46.26,6.58 | 45.83,6.4 46.26,6.22 | 46.26,6.22 | v46.33,6.4 46.26,6.22 | 45.83,6.4 46.26,6.58 | v46.33,6.4 46.26,6.58 | 45.83,6.4 46.26,6.22 | v46.33,6.4 46.26,6.22 | 45.83,6.4 46.26,6.58 | v46.33,6.4 46.26,6.58
GND  (via drill 0.33)
  other vias: 10.71,3.64 14.91,8.54
  pour Top (isolate 0.305, rank 6): 0,0 0,14 50,14 50,0
  pour Bottom (isolate 0.305, rank 6): 0,0 0,14 50,14 50,0
RST
  Top 0.203: J1.5 9.78,9.54 11.57,9.54 | MODE.P$1 12.25,12.15 12.7,12.6 18.2,12.6 18.73,12.07 U$1.1 18.73,8.57 19.3,8 20.35,8 R6.1
  Top 0.406: 11.57,9.54 12.15,9.54 MODE.P$1 12.15,10.25 12.31,10.25 | 9.78,9.54 9.3,10.05 J1.5 9.3,9.03 9.78,9.54
VCC
  Top 0.203: +.1 4.21,5.01 4.76,4.46 5.21,4.46 J1.2 | R6.2 19.25,6.05 18.73,5.53 U$1.8 18.7,3.45 18.7,1.9 18.2,1.4 10.3,1.4 9.6,2.1 C1.1 8.4,2.24 8.4,3.2 7.4,3.2 6.9,3.7 6.22,4.38 J1.2 | 6.22,4.42 J1.2
  Top 0.406: J1.2 5.69,3.95 5.21,4.46 5.69,4.97 J1.2 | J1.2 6.96,4.4 6.9,3.7 6.2,3.72 J1.2 | 4.21,5.01 4.23,5.71 +.1 3.51,4.99 4.21,5.01
  Bottom 0.406: 6.22,2.28 6.22,3.44 J1.2 | VCCEXT.P$1 6.22,2.28 | 6.22,2.28 6.22,2
  Bottom 0.813: 6.22,3.44 6.68,4.18 J1.2 5.77,4.18 6.22,3.44

### Text on the board
tPlace: 1 | 2 | 3 | 4 | 5 | R6 | - | ATtiny85 | + | Stick Ed! | v4 | C1 | MODE
bPlace: - | pfriedel | - | 4.5v | + | 2013 | +
bStop: \\O_o/